# EasyEDA schematic SCH_PCB3-ROBOTIC-DRA-KIT_2024-08-23 V1.1.0.json
TITLE: REMOTE CONTROLLER DRA; REV: 1.0; Date: 2024-08-22; Sheet: 1/1; Drawn By: VIDITTYAGI; Company: STEMROBO
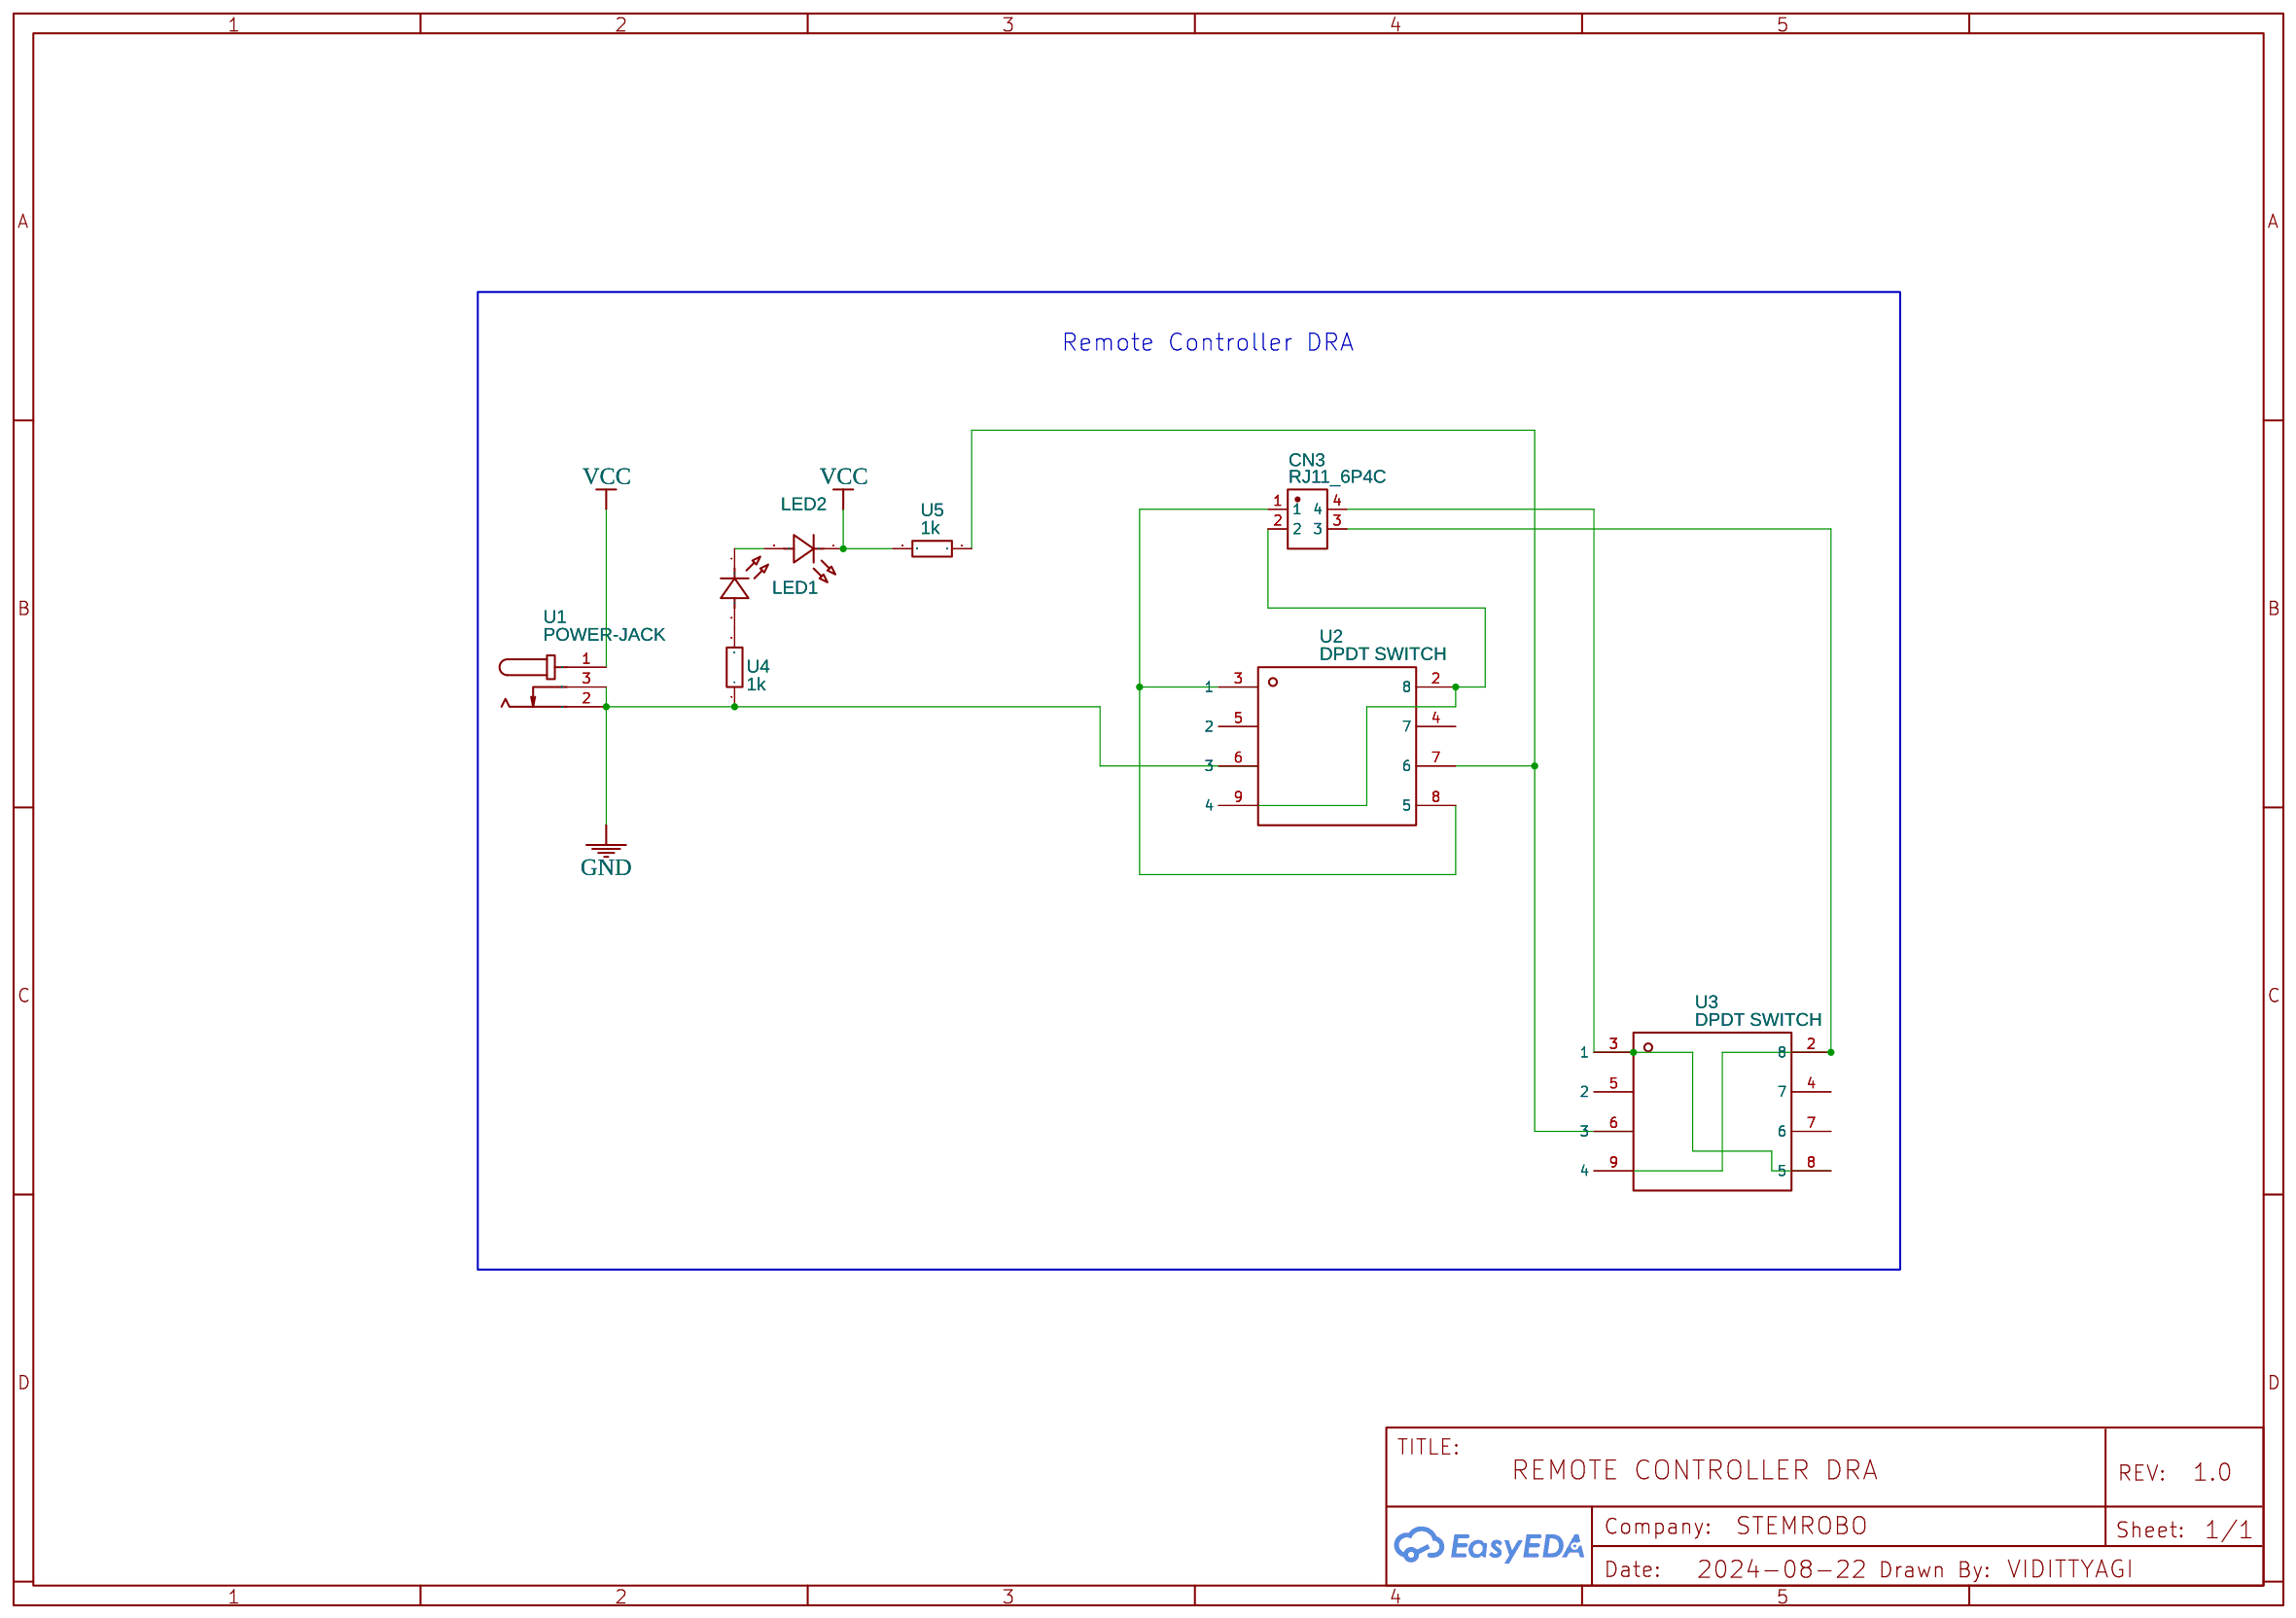
[diagram p0: schematic sheet]

## Parts
CN3  RJ11_6P4C  [CONN-TH_RJ11_6P4C]
LED1  15400394A3590  [LED-TH_BD3.0-P2.54-RD-RED]
LED2  15400394A3590  [LED-TH_BD3.0-P2.54-RD-RED]
U1  POWER-JACK  [DC-IN-TH_POWER-JACK]
U2  DPDT SWITCH  [DPDT SWITCH]
U3  DPDT SWITCH  [DPDT SWITCH]
U4  1k  [RES-TH_BD3.3-L9.0-P13.00-D0.6]
U5  1k  [RES-TH_BD3.3-L9.0-P13.00-D0.6]

## Library data of the parts
CN3 = RJ11_6P4C: Contributor: lcsc; Supplier: LCSC; Supplier Part: C9900020346; Manufacturer: null; JLCPCB Part Class: Extended Part
LED1 LED2 = 15400394A3590: Supplier: LCSC; Supplier Part: C5478689; Manufacturer: Wurth(伍尔特); Contributor: lcsc; JLCPCB Part Class: Extended Part
U1 = POWER-JACK: Contributor: LCSC; Supplier: LCSC; Supplier Part: C9900001795; Manufacturer: 索峰; JLCPCB Part Class: Extended Part
U2 U3 = DPDT SWITCH: Supplier: RS-Online; Contributor: vidittyagi
U4 U5 = CFR1WSJT-52-1K6: Contributor: lcsc; Supplier: LCSC; Supplier Part: C1373109; Manufacturer: YAGEO(国巨); JLCPCB Part Class: Extended Part

## Nets
GND: U1.2 U1.3 U2.6(3) U4.1
VCC: LED2.1(K) U1.1 U5.2
Net-(CN3-1): CN3.1 U2.3(1) U2.8(5)
Net-(CN3-2): CN3.2 U2.2(8) U2.9(4)
Net-(CN3-3): CN3.3 U3.2(8) U3.9(4)
Net-(CN3-4): CN3.4 U3.3(1) U3.8(5)
Net-(LED1-1): LED1.1(K) LED2.2(A)
Net-(LED1-2): LED1.2(A) U4.2
Net-(U2-7): U2.7(6) U3.6(3) U5.1

Not connected (* = marked no-connect by the designer): U2 4(7) 5(2); U3 4(7) 5(2) 7(6)

## Notes on the sheet
- Remote Controller DRA
